# Altium schematic sheet Sheet1.SchDoc
size A4
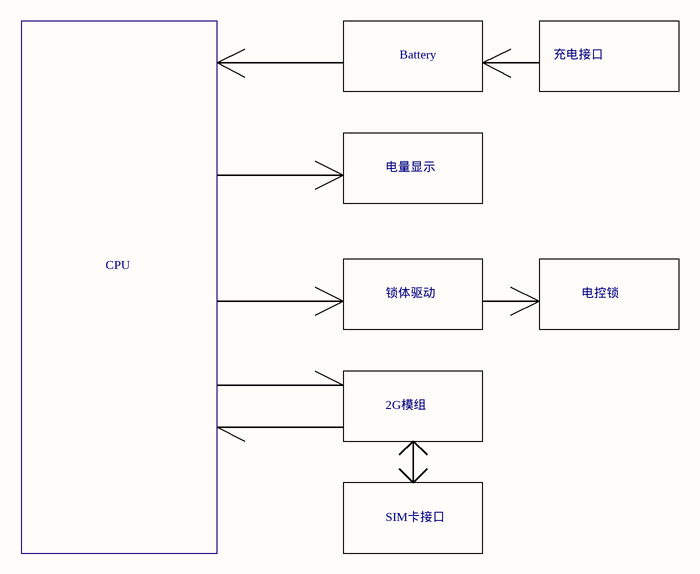
[diagram p0: Sheet1.SchDoc]

## Notes on the sheet
- Battery
- 充电接口
- 电量显示
- CPU
- 锁体驱动
- 电控锁
- 2G模组
- SIM卡接口